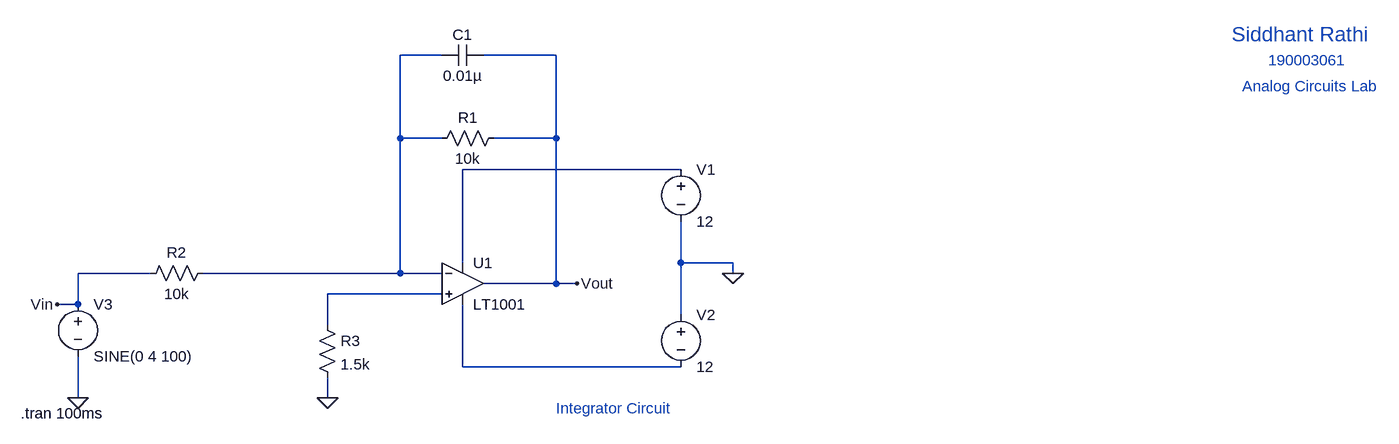
[diagram p0: schematic integrator.asc]
integrator.asc, the LTspice schematic file:
Version 4
SHEET 1 1940 680
WIRE 176 -192 112 -192
WIRE 352 -192 240 -192
WIRE 112 -64 112 -192
WIRE 176 -64 112 -64
WIRE 352 -64 352 -192
WIRE 352 -64 256 -64
WIRE 544 -16 208 -16
WIRE 208 128 208 -16
WIRE 544 128 544 64
WIRE 624 128 544 128
WIRE -272 144 -384 144
WIRE 112 144 112 -64
WIRE 112 144 -192 144
WIRE 176 144 112 144
WIRE 624 144 624 128
WIRE 352 160 352 -64
WIRE 352 160 240 160
WIRE 384 160 352 160
WIRE 176 176 0 176
WIRE -384 192 -384 144
WIRE -384 192 -416 192
WIRE 544 208 544 128
WIRE 0 224 0 176
WIRE 208 288 208 192
WIRE 544 288 208 288
WIRE -384 336 -384 272
WIRE 0 336 0 304
FLAG -384 336 0
FLAG 0 336 0
FLAG 624 144 0
FLAG -416 192 Vin
FLAG 384 160 Vout
SYMBOL OpAmps\\LT1001 208 96 R0
SYMATTR InstName U1
SYMBOL voltage 544 -32 R0
WINDOW 123 0 0 Left 0
WINDOW 39 0 0 Left 0
SYMATTR InstName V1
SYMATTR Value 12
SYMBOL voltage 544 192 R0
WINDOW 123 0 0 Left 0
WINDOW 39 0 0 Left 0
SYMATTR InstName V2
SYMATTR Value 12
SYMBOL voltage -384 176 R0
WINDOW 123 0 0 Left 0
WINDOW 39 0 0 Left 0
SYMATTR InstName V3
SYMATTR Value SINE(0 4 100)
SYMBOL res -16 208 R0
SYMATTR InstName R3
SYMATTR Value 1.5k
SYMBOL res -176 128 R90
WINDOW 0 0 56 VBottom 2
WINDOW 3 32 56 VTop 2
SYMATTR InstName R2
SYMATTR Value 10k
SYMBOL res 272 -80 R90
WINDOW 0 0 56 VBottom 2
WINDOW 3 32 56 VTop 2
SYMATTR InstName R1
SYMATTR Value 10k
SYMBOL cap 240 -208 R90
WINDOW 0 0 32 VBottom 2
WINDOW 3 32 32 VTop 2
SYMATTR InstName C1
SYMATTR Value 0.01µ
TEXT -472 360 Left 2 !.tran 100ms
TEXT 352 352 Left 2 ;Integrator Circuit
TEXT 1392 -224 Left 3 ;Siddhant Rathi
TEXT 1408 -144 Left 2 ;Analog Circuits Lab
TEXT 1448 -184 Left 2 ;190003061

The netlist it stands for:
* integrator.asc
XU1 N003 N001 N002 N004 Vout LT1001  ; pins In+ In- V+ V- OUT
V1 N002 0 12
V2 0 N004 12
V3 Vin 0 SINE(0 4 100)
R3 N003 0 1.5k
R2 N001 Vin 10k
R1 Vout N001 10k
C1 Vout N001 0.01µ
.tran 100ms
* Integrator Circuit
* Siddhant Rathi
* Analog Circuits Lab
* 190003061
.lib LTC.lib
.backanno
.end